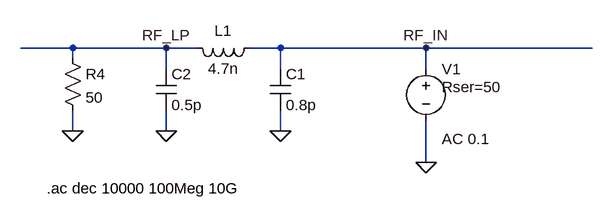
[diagram p0: schematic BLE FrontEnd.asc]
BLE FrontEnd.asc, the LTspice schematic file:
Version 4
SHEET 1 884 680
WIRE 0 112 -80 112
WIRE 144 112 0 112
WIRE 192 112 144 112
WIRE 320 112 272 112
WIRE 544 112 320 112
WIRE 800 112 544 112
WIRE 0 128 0 112
WIRE 144 144 144 112
WIRE 320 144 320 112
WIRE 544 144 544 112
WIRE 0 240 0 208
WIRE 144 240 144 208
WIRE 320 240 320 208
WIRE 544 288 544 224
FLAG 144 240 0
FLAG 320 240 0
FLAG 544 288 0
FLAG 0 240 0
FLAG 544 112 RF_IN
FLAG 144 112 RF_LP
SYMBOL cap 304 144 R0
SYMATTR InstName C1
SYMATTR Value 0.8p
SYMBOL cap 128 144 R0
SYMATTR InstName C2
SYMATTR Value 0.5p
SYMBOL ind 288 96 R90
WINDOW 0 5 56 VBottom 2
WINDOW 3 32 56 VTop 2
SYMATTR InstName L1
SYMATTR Value 4.7n
SYMBOL voltage 544 128 R0
WINDOW 123 24 124 Left 2
WINDOW 39 24 44 Left 2
SYMATTR Value2 AC 0.1
SYMATTR SpiceLine Rser=50
SYMATTR InstName V1
SYMATTR Value ""
SYMBOL res -16 112 R0
SYMATTR InstName R4
SYMATTR Value 50
TEXT -40 328 Left 2 !.ac dec 10000 100Meg 10G

The netlist it stands for:
* BLE FrontEnd.asc
C1 RF_IN 0 0.8p
C2 RF_LP 0 0.5p
L1 RF_IN RF_LP 4.7n
V1 RF_IN 0 AC 0.1 Rser=50
R4 RF_LP 0 50
.ac dec 10000 100Meg 10G
.backanno
.end